# EAGLE schematic axoloti_knobs_bottom (EAGLE 7.4.0)
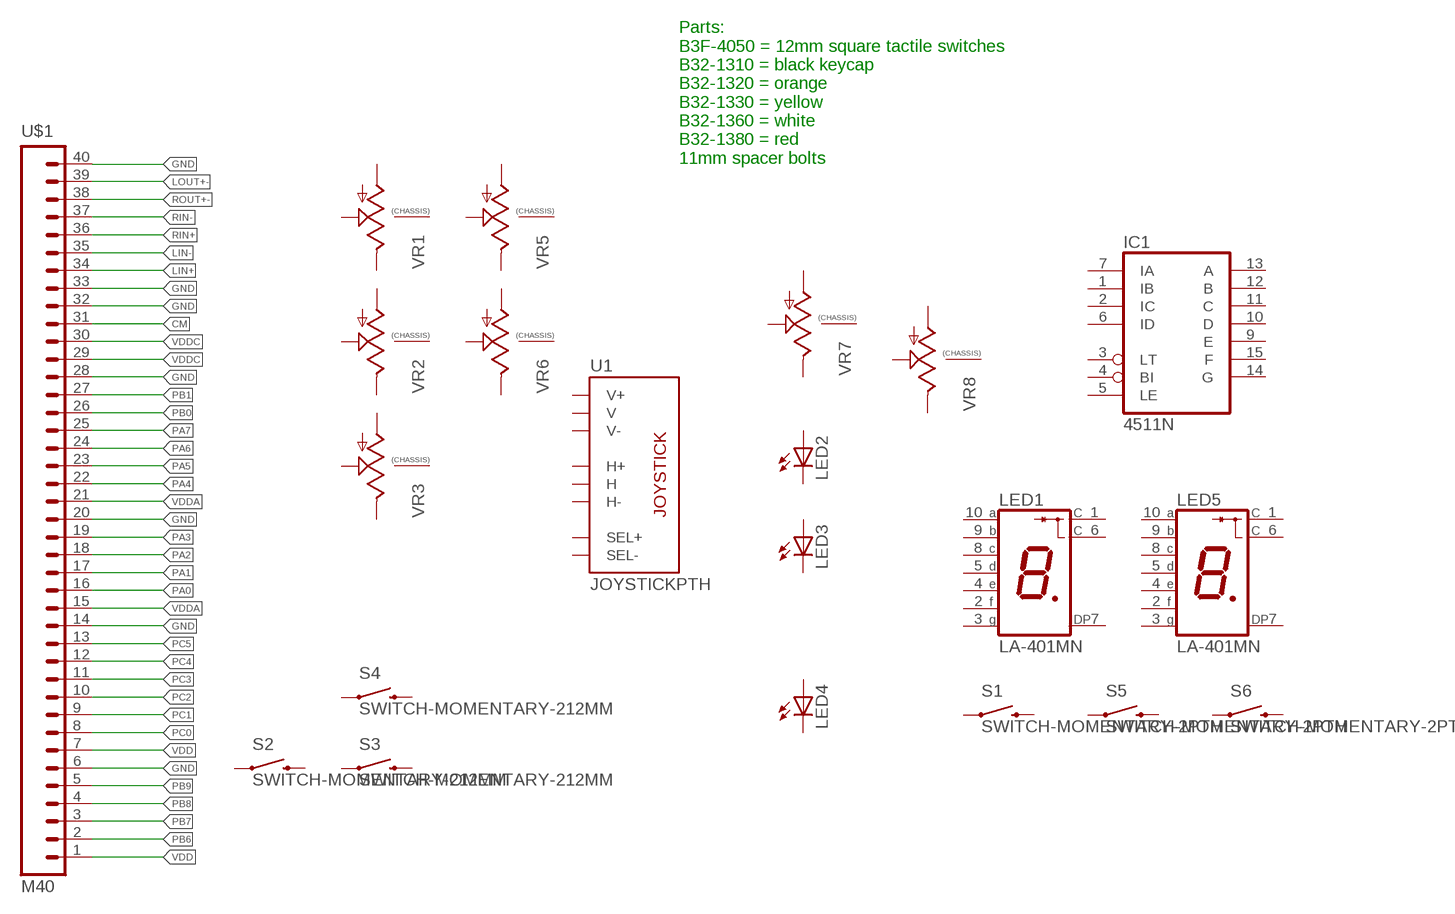
[diagram p0: schematic, sheet 1]

## Parts
IC1  4511N  [DIL16]
LED1  LA-401MN  [LA-401]
LED2  LED3MM  [LED3MM]
LED3  LED3MM  [LED3MM]
LED4  LED3MM  [LED3MM]
LED5  LA-401MN  [LA-401]
S1  SWITCH-MOMENTARY-2PTH  [TACTILE-PTH]
S2  SWITCH-MOMENTARY-212MM  [TACTILE-PTH-12MM]
S3  SWITCH-MOMENTARY-212MM  [TACTILE-PTH-12MM]
S4  SWITCH-MOMENTARY-212MM  [TACTILE-PTH-12MM]
S5  SWITCH-MOMENTARY-2PTH  [TACTILE-PTH]
S6  SWITCH-MOMENTARY-2PTH  [TACTILE-PTH]
U1  JOYSTICKPTH  [JOYSTICK]
U$1  M40  [1X40]
VR1  9MM_SNAP-IN_POT_CHASSIS  [9MM_SNAP-IN_POT]
VR2  9MM_SNAP-IN_POT_CHASSIS  [9MM_SNAP-IN_POT]
VR3  9MM_SNAP-IN_POT_CHASSIS  [9MM_SNAP-IN_POT]
VR5  9MM_SNAP-IN_POT_CHASSIS  [9MM_SNAP-IN_POT]
VR6  9MM_SNAP-IN_POT_CHASSIS  [9MM_SNAP-IN_POT]
VR7  9MM_SNAP-IN_POT_CHASSIS  [9MM_SNAP-IN_POT]
VR8  9MM_SNAP-IN_POT_CHASSIS  [9MM_SNAP-IN_POT]

## Nets
CM: U$1.31
GND: U$1.6 U$1.14 U$1.20 U$1.28 U$1.32 U$1.33 U$1.40
LIN+: U$1.34
LIN-: U$1.35
LOUT+-: U$1.39
PA0: U$1.16
PA1: U$1.17
PA2: U$1.18
PA3: U$1.19
PA4: U$1.22
PA5: U$1.23
PA6: U$1.24
PA7: U$1.25
PB0: U$1.26
PB1: U$1.27
PB6: U$1.2
PB7: U$1.3
PB8: U$1.4
PB9: U$1.5
PC0: U$1.8
PC1: U$1.9
PC2: U$1.10
PC3: U$1.11
PC4: U$1.12
PC5: U$1.13
RIN+: U$1.36
RIN-: U$1.37
ROUT+-: U$1.38
VDD: U$1.1 U$1.7
VDDA: U$1.15 U$1.21
VDDC: U$1.29 U$1.30
Unconnected: IC1.1(IB) IC1.2(IC) IC1.3(LT) IC1.4(BI) IC1.5(LE) IC1.6(ID) IC1.7(IA) IC1.9(E) IC1.10(D) IC1.11(C) IC1.12(B) IC1.13(A) IC1.14(G) IC1.15(F) LED1.1(C) LED1.2(F) LED1.3(G) LED1.4(E) LED1.5(D) LED1.6(C) LED1.7(DP) LED1.8(C) LED1.9(B) LED1.10(A) LED2.A LED2.K(C) LED3.A LED3.K(C) LED4.A LED4.K(C) LED5.1(C) LED5.2(F) LED5.3(G) LED5.4(E) LED5.5(D) LED5.6(C) LED5.7(DP) LED5.8(C) LED5.9(B) LED5.10(A) S1.1 S1.3 S2.1 S2.3 S3.1 S3.3 S4.1 S4.3 S5.1 S5.3 S6.1 S6.3 U1.B1A(SEL+) U1.B2A(SEL-) U1.H1(H+) U1.H2(H) U1.H3(H-) U1.V1(V+) U1.V2(V) U1.V3(V-) VR1.1(A) VR1.2(S) VR1.3(E) VR1.CHASSIS2 VR2.1(A) VR2.2(S) VR2.3(E) VR2.CHASSIS2 VR3.1(A) VR3.2(S) VR3.3(E) VR3.CHASSIS2 VR5.1(A) VR5.2(S) VR5.3(E) VR5.CHASSIS2 VR6.1(A) VR6.2(S) VR6.3(E) VR6.CHASSIS2 VR7.1(A) VR7.2(S) VR7.3(E) VR7.CHASSIS2 VR8.1(A) VR8.2(S) VR8.3(E) VR8.CHASSIS2

## Notes on the sheet
- Parts: 
  B3F-4050 = 12mm square tactile switches 
  B32-1310 = black keycap 
  B32-1320 = orange 
  B32-1330 = yellow 
  B32-1360 = white
  B32-1380 = red 
  11mm spacer bolts

## Power pins joined to a net without a drawn wire
VDD: IC1.16(VDD)
VSS: IC1.8(VSS)

## Library data of the parts
IC1 = 45xx:4511: BCD to 7-segment LATCH/DECODER/DRIVER
LED1 LED5 = led-7-segment:LA-401*N: Single Digit LED Numeric Display (cathode common) Source: ROHM .. la-1401dn.pdf; OC_FARNELL: unknown; OC_NEWARK: unknown
LED2-LED4 = SparkFun-LED:LED: LEDs Standard schematic elements and footprints for 5mm, 3mm, 1206, and 0603 sized LEDs. 5mm - Spark Fun Electronics SKU : COM-00529 (and others)
S1 S5 S6 = SparkFun-Electromechanical:SWITCH-MOMENTARY-2: Various NO switches- pushbuttons, reed, etc
S2-S4 = SparkFun-Electromechanical:SWITCH-MOMENTARY-2: Various NO switches- pushbuttons, reed, etc; PROD_ID: SWCH-09185
U1 = SparkFun-Electromechanical:JOYSTICK: Thumb Joystick Joystick commonly found in PS2 controllers. Two pots and a select switch. Footprint proven. Spark Fun Electronics SKU : COM-09032
U$1 = SparkFun-Connectors:M40: 1x40 .1" header
VR1-VR3 VR5-VR8 = MusicThingModular:9MM_SNAP-IN_POT_CHASSIS: 9mm vertical snap-in pot, Alpha / Panasonic style, with a connection to the metal chassis for grounding